# EAGLE design IO_BOTTOM_PCB  BOARD (EAGLE 9.6.2)
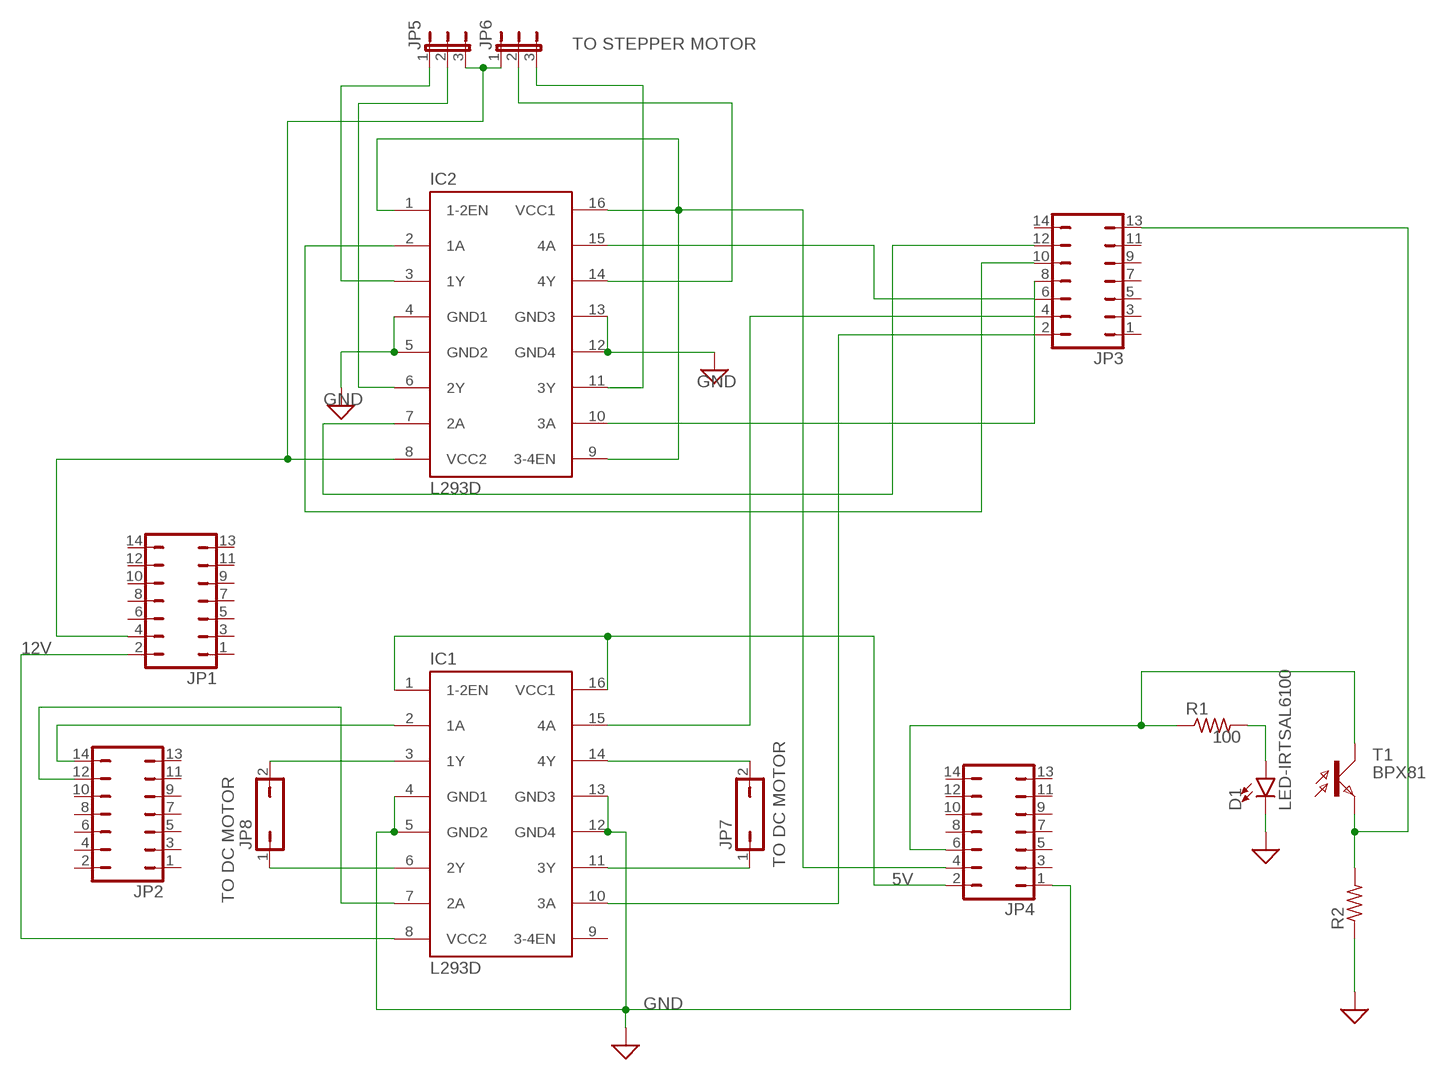
[diagram p0: schematic, sheet 1]

## Parts
D1  LED-IRTSAL6100  [LED_5MM]
IC1  L293D  [DIL16]
IC2  L293D  [DIL16]
JP1  JP7Q  [JP7Q]
JP2  JP7Q  [JP7Q]
JP3  JP7Q  [JP7Q]
JP4  JP7Q  [JP7Q]
JP5  JP2E  [JP2]
JP6  JP2E  [JP2]
JP7  JP1Q  [JP1]
JP8  JP1Q  [JP1]
R1  R-US_0204/2V  [0204V]
R2  R-US_0204/2V  [0204V]
T1  BPX81  [BPX81]

## Nets
5V: IC1.8(VCC2) JP1.2
GND: D1.K(C) IC1.4(GND1) IC1.5(GND2) IC1.12(GND4) IC1.13(GND3) IC2.4(GND1) IC2.5(GND2) IC2.12(GND4) IC2.13(GND3) JP4.1 R2.1 ; supply symbol labelled SUP
N$1: IC1.3(1Y) JP8.2
N$2: IC1.6(2Y) JP8.1
N$3: IC1.11(3Y) JP7.1
N$4: IC1.14(4Y) JP7.2
N$5: IC1.2(1A) JP2.14
N$6: IC1.7(2A) JP2.12
N$7: IC1.1(1-2EN) IC1.16(VCC1) JP4.2
N$8: IC1.15(4A) JP3.4
N$9: IC1.10(3A) JP3.2
N$10: IC2.15(4A) JP3.6
N$11: IC2.10(3A) JP3.8
N$12: IC2.2(1A) JP3.10
N$13: IC2.7(2A) JP3.12
N$14: IC2.1(1-2EN) IC2.9(3-4EN) IC2.16(VCC1) JP4.4
N$15: IC2.6(2Y) JP5.2
N$16: IC2.3(1Y) JP5.1
N$17: IC2.11(3Y) JP6.3
N$18: IC2.8(VCC2) JP1.4 JP5.3 JP6.1
N$19: IC2.14(4Y) JP6.2
N$20: D1.A R1.2
N$21: JP3.13 R2.2 T1.E
N$22: JP4.6 R1.1 T1.C
Unconnected: IC1.9(3-4EN) JP1.1 JP1.3 JP1.5 JP1.6 JP1.7 JP1.8 JP1.9 JP1.10 JP1.11 JP1.12 JP1.13 JP1.14 JP2.1 JP2.2 JP2.3 JP2.4 JP2.5 JP2.6 JP2.7 JP2.8 JP2.9 JP2.10 JP2.11 JP2.13 JP3.1 JP3.3 JP3.5 JP3.7 JP3.9 JP3.11 JP3.14 JP4.3 JP4.5 JP4.7 JP4.8 JP4.9 JP4.10 JP4.11 JP4.12 JP4.13 JP4.14

## Notes on the sheet
- TO STEPPER MOTOR
- GND
- GND
- 12V
- 100
- TO DC MOTOR
- TO DC MOTOR
- GND

## Library data of the parts
D1 = SparkFun-LED:LED-IR: Infrared LED (IR) Wavelength: 940nm Packages: TSAL6100 LTE302 - Side firing. Check SparkFun-Sensors.lbr for the receiver SparkFun Products: ZX Distance and Gesture Sensor <[https://www.sparkfun.com/products/12780]> Infrared Emitters and Detectors <https://www.sparkfun.com/products/241>; PROD_ID: DIO-12058
IC1 IC2 = st-microelectronics:L293D: PUSH-PULL 4 CHANNEL DRIVER; MPN: L293D; OC_FARNELL: 9589619; OC_NEWARK: 56P8249
JP1-JP4 = jumper:JP7Q: JUMPER
JP5 JP6 = jumper:JP2E: JUMPER
JP7 JP8 = jumper:JP1Q: JUMPER
R1 R2 = rcl:R-US_: RESISTOR, American symbol; SPICEPREFIX: R
T1 = opto-trans-siemens:BPX81: PHOTO TRANSISTOR; OC_FARNELL: unknown; OC_NEWARK: unknown

## Board
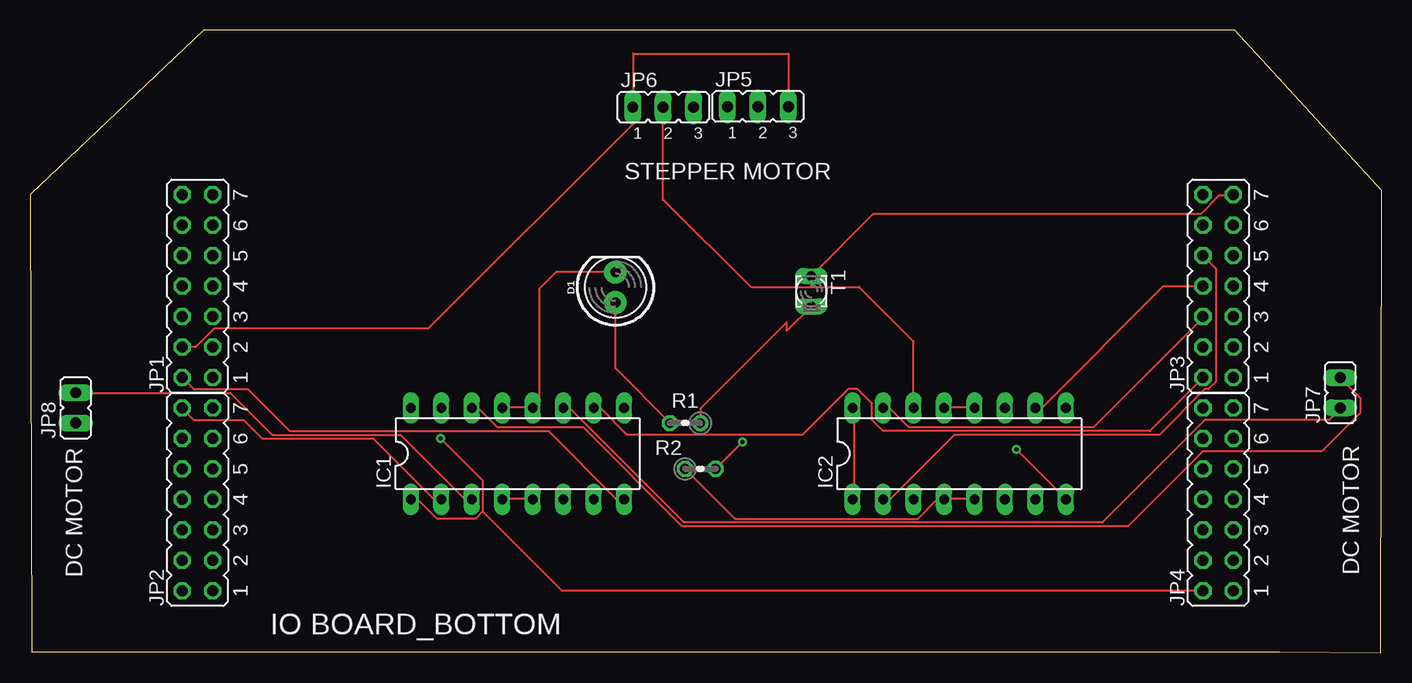
[diagram p1: board, top side]
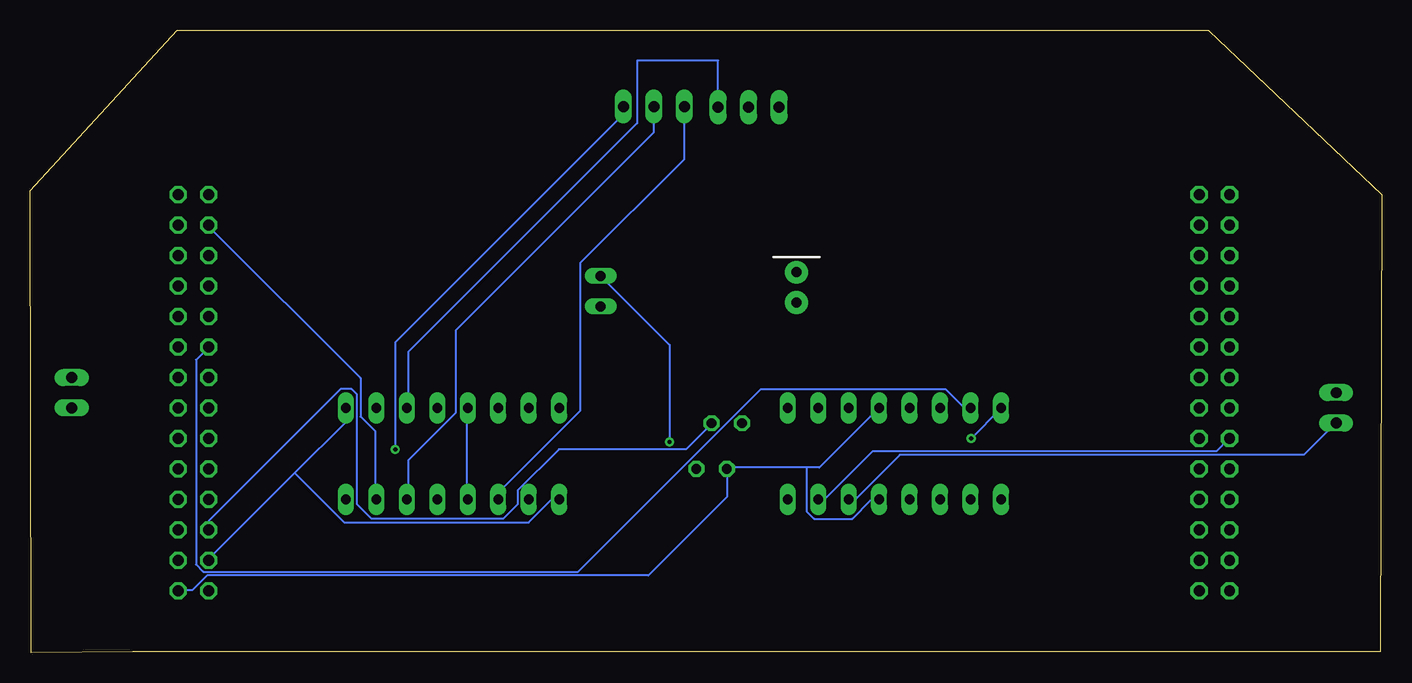
[diagram p2: board, bottom side, seen from below]

Size 112.7 x 51.95 mm. Coordinates in mm from the lower left corner, seen from the top.
Outline: 0,38.21 0.12,0.11 8.89,0.11 104.14,0.11 112.6,0 112.7,38.55 100.44,51.95 14.47,51.95 0,38.21
Copper layers (1*16): Top 0.035mm / dielectric 1.5mm / Bottom 0.035mm
Design rules "default": minimum track width 6mil, minimum drill 0.35mm, track to track 6mil, track to pad 6mil, pad to pad 6mil, via to via 6mil, smd to smd 6mil, copper to edge 40mil, drill to drill 6mil, minimum pad ring 10mil, minimum via ring 8mil, stop-mask expansion 4mil, vias tented up to drill 0mil, thermal gap 10mil

### Footprints (pad centres in the part's own frame; a part is rotated, then mirrored left to right if it is on the bottom)
LED_5MM = drill 0.813 pad 1.88: A -1.27,0; K 1.27,0
DIL16 = drill 0.813 long: 1 -8.89,-3.81; 2 -6.35,-3.81; 3 -3.81,-3.81; 4 -1.27,-3.81; 5 1.27,-3.81; 6 3.81,-3.81; 7 6.35,-3.81; 8 8.89,-3.81; 9 8.89,3.81; 10 6.35,3.81; 11 3.81,3.81; 12 1.27,3.81; 13 -1.27,3.81; 14 -3.81,3.81; 15 -6.35,3.81; 16 -8.89,3.81
JP7Q = drill 0.914 octagon: 1 -7.62,-1.27; 2 -7.62,1.27; 3 -5.08,-1.27; 4 -5.08,1.27; 5 -2.54,-1.27; 6 -2.54,1.27; 7 0,-1.27; 8 0,1.27; 9 2.54,-1.27; 10 2.54,1.27; 11 5.08,-1.27; 12 5.08,1.27; 13 7.62,-1.27; 14 7.62,1.27
JP2 = drill 0.914 long: 1 -2.54,0; 2 0,0; 3 2.54,0
JP1 = drill 0.914 long: 1 0,-1.27; 2 0,1.27
0204V = drill 0.813 octagon: 1 -1.27,0; 2 1.27,0
BPX81 = drill 0.813 long: C 1.27,0; E -1.27,0

### Placement (x,y rotation side)
D1  48.8,30.49 90 top
IC1  40.64,16.62 0 top
IC2  77.47,16.62 0 top
JP1  13.97,30.59 90 top
JP2  13.97,12.81 90 top
JP3  99.06,30.59 90 top
JP4  99.06,12.81 90 top
JP5  60.69,45.56 0 top
JP6  52.79,45.52 0 top
JP7  109.22,21.7 0 top
JP8  3.81,20.44 0 top
R1  54.61,19.16 180 top
R2  55.88,15.35 0 top
T1  65.13,30.17 270 top

### Tracks (layer width: path | path; a pad name or v marks a point on that pad's centre or on a via)
5V
  Top 0.152: JP1.2 13.67,22.01 18.14,22.01 21.65,18.51 43.23,18.51 48.87,12.87 49.48,12.87 IC1.8
GND
  Top 0.152: IC2.5 78.74,12.87 76.3,12.87 IC2.4 76.15,12.71 75.54,12.71 74.02,11.19 58.78,11.19 R2.1 | IC2.13 76.3,20.49 78.74,20.49 IC2.12 | IC1.4 39.42,12.87 41.86,12.87 IC1.5 | IC1.13 39.42,20.49 41.86,20.49 IC1.12 42.49,20.72 42.49,30.41 43.84,31.77 D1.K
  Bottom 0.152: IC2.4 76.3,12.87 76.3,20.33 IC2.13 | 47.95,15.46 46.89,15.46 IC1.12 | 47.95,15.46 54.51,15.46 R2.1 54.61,13.01 61.15,6.46 97.94,6.46 99.16,5.25 100.23,5.25 JP4.1 | 47.95,15.46 47.95,11.8 47.35,11.19 44.15,11.19 42.62,12.71 42.01,12.71 IC1.5
N$1
  Top 0.152: JP8.2 16.69,21.7 20.2,18.2 30.89,18.2 36.22,12.87 36.83,12.87 IC1.3
N$2
  Bottom 0.152: IC1.6 44.45,12.87 43.84,12.87 40.18,16.52 6.5,16.52 3.91,19.11 JP8.1
N$3
  Top 0.152: IC1.11 44.45,20.33 45.06,20.33 54.51,10.88 89.41,10.88 97.94,19.42 108.31,19.42 109.22,20.33 JP7.1
N$4
  Top 0.152: IC1.14 36.83,20.33 37.44,20.33 38.96,18.81 46.13,18.81 54.36,10.58 91.54,10.58 97.79,16.83 107.7,16.83 110.9,20.03 110.9,21.25 109.22,22.92 JP7.2
N$5
  Top 0.152: IC1.2 34.24,12.87 33.63,12.87 28.6,17.89 19.34,17.89 17.81,19.42 13.67,19.42 12.75,20.33 JP2.14
N$6
  Bottom 0.152: IC1.7 46.89,12.87 46.43,12.87 42.47,16.83 13.82,16.83 12.75,17.89 JP2.12
N$7  (via drill 0.35)
  Top 0.152: 37.74,11.8 37.14,11.19 33.93,11.19 32.41,12.71 31.8,12.71 IC1.1 | 37.74,11.8 37.74,14.39 v34.24,17.89 | 37.74,11.8 44.3,5.25 97.79,5.25 JP4.2
  Bottom 0.152: v34.24,17.89 31.8,20.33 IC1.16
N$8
  Bottom 0.152: JP3.4 98.86,24.45 98.86,7.38 98.25,6.77 67,6.77 51.77,22.01 36.37,22.01 34.85,20.49 34.39,20.49 IC1.15
N$9
  Top 0.152: IC1.10 47.04,20.33 47.65,20.33 49.78,18.2 64.41,18.2 68.22,22.01 68.99,22.01 70.21,20.79 70.21,19.42 71.12,18.51 93.37,18.51 97.79,22.92 JP3.2
N$10
  Top 0.152: IC2.15 71.12,20.33 71.73,20.33 73.25,18.81 88.65,18.81 97.79,27.95 JP3.6
N$11
  Top 0.152: IC2.10 83.92,20.49 84.38,20.49 94.44,30.54 97.79,30.54 JP3.8
N$12
  Top 0.152: JP3.10 98.86,32.07 98.86,22.62 98.25,22.01 97.94,22.01 94.13,18.2 77.06,18.2 71.73,12.87 71.12,12.87 IC2.2
N$13
  Bottom 0.152: IC2.7 83.92,12.87 83.92,18.51 85.14,19.72 85.14,22.92 97.79,35.57 JP3.12
N$14
  Top 0.152: IC2.1 68.68,12.87 68.68,20.33 IC2.16
  Bottom 0.152: IC2.9 86.36,19.27 90.63,15 | 90.63,15 97.79,7.84 JP4.4 | 90.63,15 86.51,10.88 71.12,10.88 69.29,12.71 68.68,12.71 IC2.1
N$15
  Bottom 0.152: IC2.6 81.18,12.87 81.18,16.07 77.22,20.03 77.22,26.88 60.69,43.41 JP5.2
N$16
  Bottom 0.152: IC2.3 73.56,12.87 73.56,13.48 66.83,20.2 66.83,32.51 58.15,41.19 JP5.1
N$17
  Bottom 0.152: IC2.11 81.18,20.49 81.18,25.1 62.09,44.18 62.09,49.41 55.33,49.41 JP6.3
N$18  (via drill 0.35)
  Top 0.152: v82.25,16.98 86.36,12.87 IC2.8 | JP1.4 13.82,25.52 15.34,27.04 33.17,27.04 50.25,44.12 JP6.1 50.25,49.99 63.23,49.99 JP5.3
  Bottom 0.152: v82.25,16.98 82.25,25.89 63.23,44.92 JP5.3
N$19
  Top 0.152: IC2.14 73.66,25.98 69.11,30.52 60.09,30.52 52.87,37.74 52.79,37.74 JP6.2
N$20
  Top 0.152: R1.2 53.29,19.27 48.8,23.75 D1.A
N$21  (via drill 0.35)
  Top 0.152: v59.39,17.59 R2.2 | T1.E 70.33,36.64 97.64,36.64 99.16,38.16 100.23,38.16 JP3.13
  Bottom 0.152: v59.39,17.59 59.39,25.7 T1.E
N$22
  Top 0.152: R1.1 55.88,20.38 63.1,27.6 63.1,26.87 T1.C
  Bottom 0.152: JP4.6 97.79,11.04 86.82,22.01 85.9,22.01 85.45,21.55 85.45,12.41 84.23,11.19 73.25,11.19 72.03,12.41 72.03,13.56 68.61,16.98 58.01,16.98 55.88,19.11 R1.1
(copper drawn outside any net)
  shapes: Top area x1

### Text on the board
tNames: STEPPER MOTOR | DC MOTOR | DC MOTOR | IO BOARD_BOTTOM